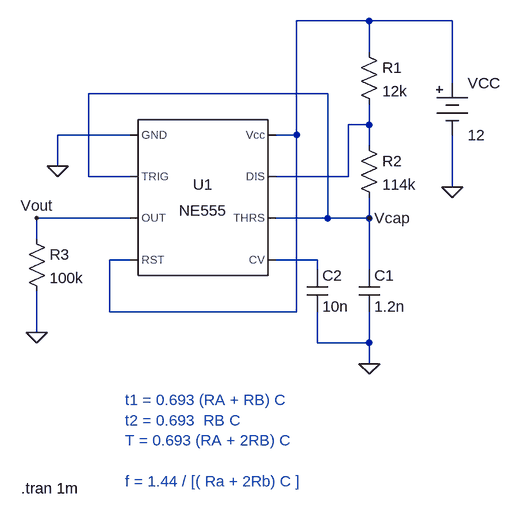
[diagram p0: schematic 3_12_pablo_gomez_tp7_ej1.asc]
3_12_pablo_gomez_tp7_ej1.asc, the LTspice schematic file:
Version 4
SHEET 1 880 680
WIRE 384 -128 272 -128
WIRE 512 -128 384 -128
WIRE 384 -80 384 -128
WIRE 512 -32 512 -128
WIRE 320 -16 -48 -16
WIRE 384 32 384 0
WIRE 384 32 352 32
WIRE 16 48 -96 48
WIRE 272 48 272 -128
WIRE 272 48 240 48
WIRE 384 64 384 32
WIRE -96 96 -96 48
WIRE -48 112 -48 -16
WIRE 16 112 -48 112
WIRE 352 112 352 32
WIRE 352 112 240 112
WIRE 512 128 512 48
WIRE 16 176 -128 176
WIRE 320 176 320 -16
WIRE 320 176 240 176
WIRE 384 176 384 144
WIRE 384 176 320 176
WIRE -128 208 -128 176
WIRE 16 240 -16 240
WIRE 304 240 240 240
WIRE 304 256 304 240
WIRE 384 256 384 176
WIRE -16 320 -16 240
WIRE 272 320 272 48
WIRE 272 320 -16 320
WIRE -128 352 -128 288
WIRE 304 368 304 320
WIRE 384 368 384 320
WIRE 384 368 304 368
WIRE 384 400 384 368
FLAG 512 128 0
FLAG 384 400 0
FLAG -96 96 0
FLAG -128 352 0
FLAG -128 176 Vout
FLAG 384 176 Vcap
SYMBOL Misc\\NE555 128 144 R0
SYMATTR InstName U1
SYMBOL Misc\\battery 512 -48 R0
SYMATTR InstName VCC
SYMATTR Value 12
SYMBOL res 368 -96 R0
SYMATTR InstName R1
SYMATTR Value 12k
SYMBOL res 368 48 R0
SYMATTR InstName R2
SYMATTR Value 114k
SYMBOL cap 368 256 R0
SYMATTR InstName C1
SYMATTR Value 1.2n
SYMBOL res -144 192 R0
SYMATTR InstName R3
SYMATTR Value 100k
SYMBOL cap 288 256 R0
SYMATTR InstName C2
SYMATTR Value 10n
TEXT 8 456 Left 2 ;t1 = 0.693 (RA + RB) C\nt2 = 0.693  RB C\nT = 0.693 (RA + 2RB) C\n \nf = 1.44 / [( Ra + 2Rb) C ]
TEXT -152 592 Left 2 !.tran 1m

The netlist it stands for:
* 3_12_pablo_gomez_tp7_ej1.asc
XU1 0 Vcap Vout N001 N003 Vcap N002 N001 NE555  ; pins GND TRIG OUT RST CV THRS DIS Vcc
VCC N001 0 12
R1 N001 N002 12k
R2 N002 Vcap 114k
C1 Vcap 0 1.2n
R3 Vout 0 100k
C2 N003 0 10n
* t1 = 0.693 (RA + RB) C
* t2 = 0.693  RB C
* T = 0.693 (RA + 2RB) C
* f = 1.44 / [( Ra + 2Rb) C ]
.tran 1m
.lib NE555.sub
.backanno
.end